# Altium schematic sheet enviroAccelerometer.SchDoc
size A
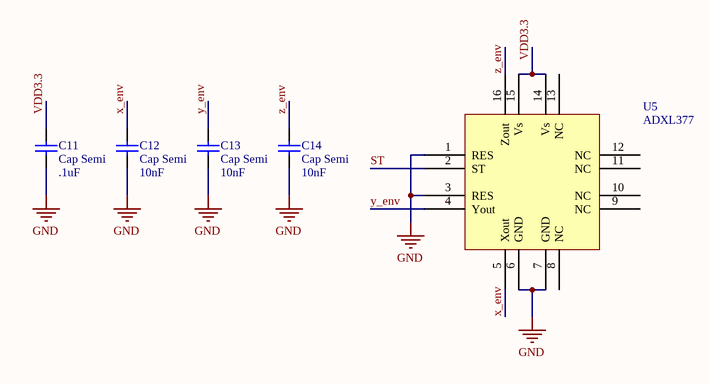
[diagram p0: enviroAccelerometer.SchDoc]

## Parts
C11  Cap Semi  value .1uF  [C1206]
C12  Cap Semi  value 10nF  [C1206]
C13  Cap Semi  value 10nF  [C1206]
C14  Cap Semi  value 10nF  [C1206]
U5  ADXL377  [ADXL377]

## Nets
GND: C11.2 C12.1 C13.1 C14.1 U5.1(RES) U5.3(RES) U5.6(GND) U5.7(GND)
ST: U5.2(ST)
VDD3.3: C11.1 U5.14(Vs) U5.15(Vs)
x_env: C12.2 U5.5(Xout)
y_env: C13.2 U5.4(Yout)
z_env: C14.2 U5.16(Zout)

Not connected (* = marked no-connect by the designer): U5 8(NC) 9(NC) 10(NC) 11(NC) 12(NC) 13(NC)

## Library data of the parts
C11-C14 = Cap Semi: Capacitor (Semiconductor SIM Model); Published: 8-Jun-2000; LatestRevisionDate: 29-May-2009; LatestRevisionNote: IPC-7351 Footprint Added.; PackageReference: C1206; Publisher: Altium Limited; PackageDescription: Chip Capacitor